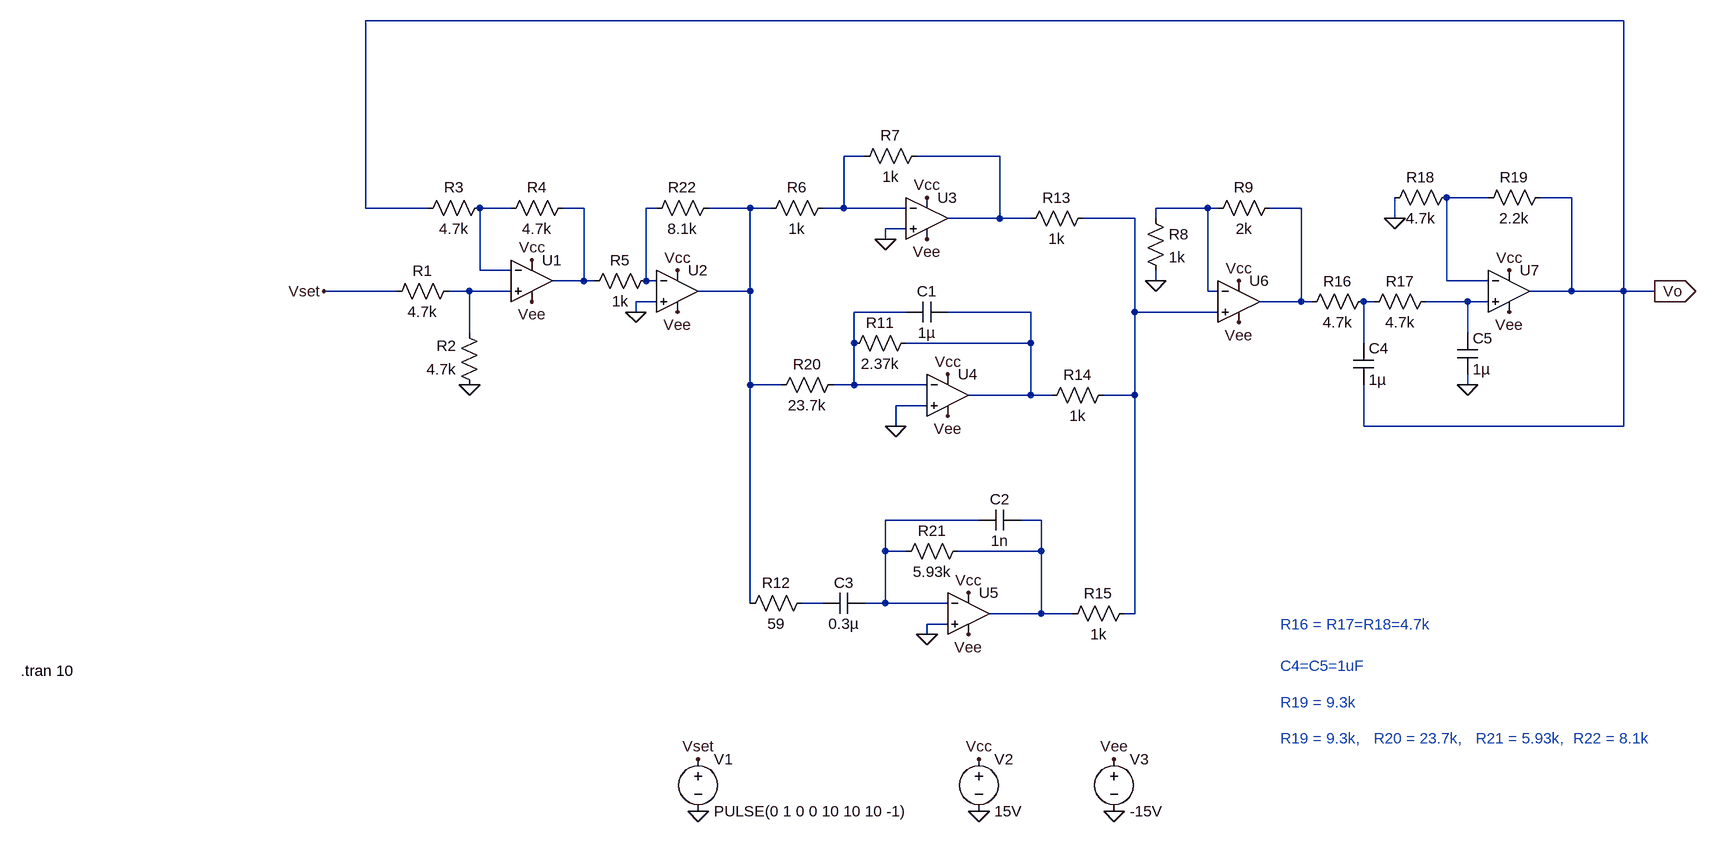
[diagram p0: schematic PID-II.asc]
PID-II.asc, the LTspice schematic file:
Version 4
SHEET 1 1208 980
WIRE 928 -256 -1008 -256
WIRE -240 -48 -272 -48
WIRE -32 -48 -160 -48
WIRE 720 16 656 16
WIRE 848 16 800 16
WIRE -1008 32 -1008 -256
WIRE -912 32 -1008 32
WIRE -784 32 -832 32
WIRE -672 32 -704 32
WIRE -560 32 -576 32
WIRE -416 32 -480 32
WIRE -384 32 -416 32
WIRE -272 32 -272 -48
WIRE -272 32 -304 32
WIRE -176 32 -272 32
WIRE 288 32 208 32
WIRE 304 32 288 32
WIRE 432 32 384 32
WIRE -32 48 -32 -48
WIRE -32 48 -112 48
WIRE 16 48 -32 48
WIRE 176 48 96 48
WIRE 208 48 208 32
WIRE 576 48 576 16
WIRE -176 64 -208 64
WIRE -208 80 -208 64
WIRE -832 128 -832 32
WIRE -784 128 -832 128
WIRE -672 144 -672 32
WIRE -672 144 -720 144
WIRE -656 144 -672 144
WIRE -576 144 -576 32
WIRE -560 144 -576 144
WIRE 208 144 208 128
WIRE 656 144 656 16
WIRE 720 144 656 144
WIRE -960 160 -1072 160
WIRE -848 160 -880 160
WIRE -784 160 -848 160
WIRE -416 160 -416 32
WIRE -416 160 -496 160
WIRE 288 160 288 32
WIRE 304 160 288 160
WIRE 848 160 848 16
WIRE 848 160 784 160
WIRE 928 160 928 -256
WIRE 928 160 848 160
WIRE 976 160 928 160
WIRE -560 176 -592 176
WIRE 432 176 432 32
WIRE 432 176 368 176
WIRE 448 176 432 176
WIRE 544 176 528 176
WIRE 688 176 624 176
WIRE 720 176 688 176
WIRE -592 192 -592 176
WIRE -176 192 -256 192
WIRE 16 192 -112 192
WIRE 176 192 176 48
WIRE 304 192 176 192
WIRE -848 224 -848 160
WIRE 688 224 688 176
WIRE -256 240 -256 192
WIRE 16 240 16 192
WIRE 16 240 -176 240
WIRE 528 240 528 176
WIRE -416 304 -416 160
WIRE -368 304 -416 304
WIRE -256 304 -256 240
WIRE -256 304 -288 304
WIRE -144 304 -256 304
WIRE 688 304 688 288
WIRE 16 320 16 240
WIRE 16 320 -80 320
WIRE 48 320 16 320
WIRE 176 320 176 192
WIRE 176 320 128 320
WIRE -144 336 -192 336
WIRE -192 368 -192 336
WIRE 528 368 528 304
WIRE 928 368 928 160
WIRE 928 368 528 368
WIRE -64 512 -208 512
WIRE 32 512 0 512
WIRE -208 560 -208 512
WIRE -176 560 -208 560
WIRE 32 560 32 512
WIRE 32 560 -96 560
WIRE -416 640 -416 304
WIRE -304 640 -336 640
WIRE -208 640 -208 560
WIRE -208 640 -240 640
WIRE -112 640 -208 640
WIRE 32 656 32 560
WIRE 32 656 -48 656
WIRE 80 656 32 656
WIRE 176 656 176 320
WIRE 176 656 160 656
WIRE -112 672 -144 672
WIRE -144 688 -144 672
FLAG -64 960 0
FLAG 144 960 0
FLAG -64 880 Vcc
FLAG 144 880 Vee
FLAG -144 80 Vee
FLAG -112 352 Vee
FLAG 752 192 Vee
FLAG -144 16 Vcc
FLAG -112 288 Vcc
FLAG 752 128 Vcc
FLAG -496 960 0
FLAG -208 80 0
FLAG -192 368 0
FLAG 688 304 0
FLAG -752 176 Vee
FLAG -752 112 Vcc
FLAG -848 304 0
FLAG -496 880 Vset
FLAG -1072 160 Vset
FLAG 976 160 Vo
IOPIN 976 160 Out
FLAG -528 192 Vee
FLAG -528 128 Vcc
FLAG -592 192 0
FLAG -80 688 Vee
FLAG -80 624 Vcc
FLAG -144 688 0
FLAG 336 208 Vee
FLAG 336 144 Vcc
FLAG 208 144 0
FLAG 576 48 0
SYMBOL OpAmps\\UniversalOpamp 752 160 R0
SYMATTR InstName U7
SYMBOL OpAmps\\UniversalOpamp -112 320 R0
SYMATTR InstName U4
SYMBOL OpAmps\\UniversalOpamp -144 48 R0
SYMATTR InstName U3
SYMBOL res 144 304 R90
WINDOW 0 0 56 VBottom 2
WINDOW 3 32 56 VTop 2
SYMATTR InstName R14
SYMATTR Value 1k
SYMBOL res -144 -64 R90
WINDOW 0 0 56 VBottom 2
WINDOW 3 32 56 VTop 2
SYMATTR InstName R7
SYMATTR Value 1k
SYMBOL res -160 224 R90
WINDOW 0 0 56 VBottom 2
WINDOW 3 32 56 VTop 2
SYMATTR InstName R11
SYMATTR Value 2.37k
SYMBOL res -272 288 R90
WINDOW 0 0 56 VBottom 2
WINDOW 3 32 56 VTop 2
SYMATTR InstName R20
SYMATTR Value 23.7k
SYMBOL res 112 32 R90
WINDOW 0 0 56 VBottom 2
WINDOW 3 32 56 VTop 2
SYMATTR InstName R13
SYMATTR Value 1k
SYMBOL res -288 16 R90
WINDOW 0 0 56 VBottom 2
WINDOW 3 32 56 VTop 2
SYMATTR InstName R6
SYMATTR Value 1k
SYMBOL res 816 0 R90
WINDOW 0 0 56 VBottom 2
WINDOW 3 32 56 VTop 2
SYMATTR InstName R19
SYMATTR Value 2.2k
SYMBOL cap -112 176 R90
WINDOW 0 0 32 VBottom 2
WINDOW 3 32 32 VTop 2
SYMATTR InstName C1
SYMATTR Value 1µ
SYMBOL voltage -496 864 R0
WINDOW 123 0 0 Left 0
WINDOW 39 0 0 Left 0
SYMATTR InstName V1
SYMATTR Value PULSE(0 1 0 0 10 10 10 -1)
SYMBOL voltage -64 864 R0
WINDOW 123 0 0 Left 0
WINDOW 39 0 0 Left 0
SYMATTR InstName V2
SYMATTR Value 15V
SYMBOL voltage 144 864 R0
WINDOW 123 0 0 Left 0
WINDOW 39 0 0 Left 0
SYMATTR InstName V3
SYMATTR Value -15V
SYMBOL OpAmps\\UniversalOpamp -752 144 R0
SYMATTR InstName U1
SYMBOL res -688 16 R90
WINDOW 0 0 56 VBottom 2
WINDOW 3 32 56 VTop 2
SYMATTR InstName R4
SYMATTR Value 4.7k
SYMBOL res -816 16 R90
WINDOW 0 0 56 VBottom 2
WINDOW 3 32 56 VTop 2
SYMATTR InstName R3
SYMATTR Value 4.7k
SYMBOL res -864 144 R90
WINDOW 0 0 56 VBottom 2
WINDOW 3 32 56 VTop 2
SYMATTR InstName R1
SYMATTR Value 4.7k
SYMBOL res -832 320 R180
WINDOW 0 36 76 Left 2
WINDOW 3 36 40 Left 2
SYMATTR InstName R2
SYMATTR Value 4.7k
SYMBOL OpAmps\\UniversalOpamp -528 160 R0
SYMATTR InstName U2
SYMBOL res -464 16 R90
WINDOW 0 0 56 VBottom 2
WINDOW 3 32 56 VTop 2
SYMATTR InstName R22
SYMATTR Value 8.1k
SYMBOL res -560 128 R90
WINDOW 0 0 56 VBottom 2
WINDOW 3 32 56 VTop 2
SYMATTR InstName R5
SYMATTR Value 1k
SYMBOL OpAmps\\UniversalOpamp -80 656 R0
SYMATTR InstName U5
SYMBOL res -80 544 R90
WINDOW 0 0 56 VBottom 2
WINDOW 3 32 56 VTop 2
SYMATTR InstName R21
SYMATTR Value 5.93k
SYMBOL res 176 640 R90
WINDOW 0 0 56 VBottom 2
WINDOW 3 32 56 VTop 2
SYMATTR InstName R15
SYMATTR Value 1k
SYMBOL res -320 624 R90
WINDOW 0 0 56 VBottom 2
WINDOW 3 32 56 VTop 2
SYMATTR InstName R12
SYMATTR Value 59
SYMBOL cap -240 624 R90
WINDOW 0 0 32 VBottom 2
WINDOW 3 32 32 VTop 2
SYMATTR InstName C3
SYMATTR Value 0.3µ
SYMBOL cap 0 496 R90
WINDOW 0 0 32 VBottom 2
WINDOW 3 32 32 VTop 2
SYMATTR InstName C2
SYMATTR Value 1n
SYMBOL OpAmps\\UniversalOpamp 336 176 R0
SYMATTR InstName U6
SYMBOL res 400 16 R90
WINDOW 0 0 56 VBottom 2
WINDOW 3 32 56 VTop 2
SYMATTR InstName R9
SYMATTR Value 2k
SYMBOL res 544 160 R90
WINDOW 0 0 56 VBottom 2
WINDOW 3 32 56 VTop 2
SYMATTR InstName R16
SYMATTR Value 4.7k
SYMBOL res 192 32 R0
SYMATTR InstName R8
SYMATTR Value 1k
SYMBOL res 640 160 R90
WINDOW 0 0 56 VBottom 2
WINDOW 3 32 56 VTop 2
SYMATTR InstName R17
SYMATTR Value 4.7k
SYMBOL cap 512 240 R0
SYMATTR InstName C4
SYMATTR Value 1µ
SYMBOL cap 672 224 R0
SYMATTR InstName C5
SYMATTR Value 1µ
SYMBOL res 672 0 R90
WINDOW 0 0 56 VBottom 2
WINDOW 3 32 56 VTop 2
SYMATTR InstName R18
SYMATTR Value 4.7k
TEXT -1456 744 Right 2 !.tran 10
TEXT 400 672 Left 2 ;R16 = R17=R18=4.7k
TEXT 400 736 Left 2 ;C4=C5=1uF
TEXT 400 792 Left 2 ;R19 = 9.3k
TEXT 400 848 Left 2 ;R19 = 9.3k,   R20 = 23.7k,   R21 = 5.93k,  R22 = 8.1k

The netlist it stands for:
* PID-II.asc
XU7 N013 N003 Vcc Vee Vo level1 Avol=1Meg GBW=10Meg Vos=0 En=0 Enk=0 In=0 Ink=0 Rin=500Meg  ; pins In+ In- V+ V- OUT
XU4 0 N014 Vcc Vee N015 level1 Avol=1Meg GBW=10Meg Vos=0 En=0 Enk=0 In=0 Ink=0 Rin=500Meg  ; pins In+ In- V+ V- OUT
XU3 0 N001 Vcc Vee N002 level1 Avol=1Meg GBW=10Meg Vos=0 En=0 Enk=0 In=0 Ink=0 Rin=500Meg  ; pins In+ In- V+ V- OUT
R14 N010 N015 1k
R7 N002 N001 1k
R11 N015 N014 2.37k
R20 N014 N007 23.7k
R13 N010 N002 1k
R6 N001 N007 1k
R19 Vo N003 2.2k
C1 N015 N014 1µ
V1 Vset 0 PULSE(0 1 0 0 10 10 10 -1)
V2 Vcc 0 15V
V3 Vee 0 -15V
XU1 N011 N004 Vcc Vee N005 level1 Avol=1Meg GBW=10Meg Vos=0 En=0 Enk=0 In=0 Ink=0 Rin=500Meg  ; pins In+ In- V+ V- OUT
R4 N005 N004 4.7k
R3 N004 Vo 4.7k
R1 N011 Vset 4.7k
R2 0 N011 4.7k
XU2 0 N006 Vcc Vee N007 level1 Avol=1Meg GBW=10Meg Vos=0 En=0 Enk=0 In=0 Ink=0 Rin=500Meg  ; pins In+ In- V+ V- OUT
R22 N007 N006 8.1k
R5 N006 N005 1k
XU5 0 N016 Vcc Vee N017 level1 Avol=1Meg GBW=10Meg Vos=0 En=0 Enk=0 In=0 Ink=0 Rin=500Meg  ; pins In+ In- V+ V- OUT
R21 N017 N016 5.93k
R15 N010 N017 1k
R12 N018 N007 59
C3 N016 N018 0.3µ
C2 N017 N016 1n
XU6 N010 N008 Vcc Vee N009 level1 Avol=1Meg GBW=10Meg Vos=0 En=0 Enk=0 In=0 Ink=0 Rin=500Meg  ; pins In+ In- V+ V- OUT
R9 N009 N008 2k
R16 N012 N009 4.7k
R8 N008 0 1k
R17 N013 N012 4.7k
C4 N012 Vo 1µ
C5 N013 0 1µ
R18 N003 0 4.7k
.tran 10
* R16 = R17=R18=4.7k
* C4=C5=1uF
* R19 = 9.3k
* R19 = 9.3k,   R20 = 23.7k,   R21 = 5.93k,  R22 = 8.1k
.lib UniversalOpAmp1.lib
.backanno
.end

* Results of the author's LTspice run, read from the files saved beside the schematic
* Operating Point, zero values left out:
*   V(vcc) = 15 V
*   V(vee) = -15 V
*   I(V3) = 210 nA
*   I(V2) = -210 nA
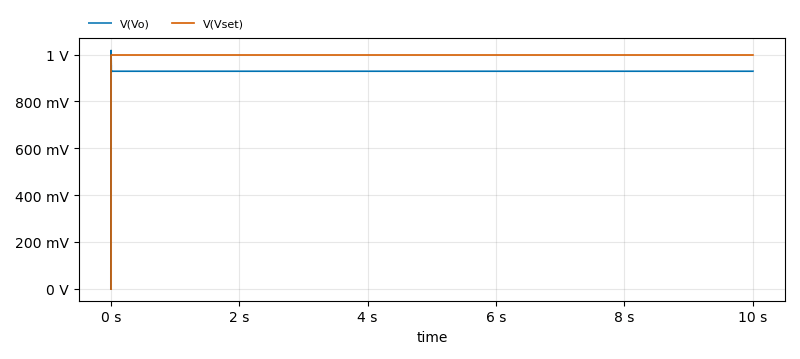
[diagram p1: Transient Analysis of PID-II.asc, plotted from the saved traces]
* Transient Analysis, 1 run:
*   V(Vo): min 0 V, max 1.018 V, average 928.9 mV, rms 929 mV, last 929 mV
*   V(Vset): min 0 V, max 1 V, average 1 V, rms 1 V, last 1 V